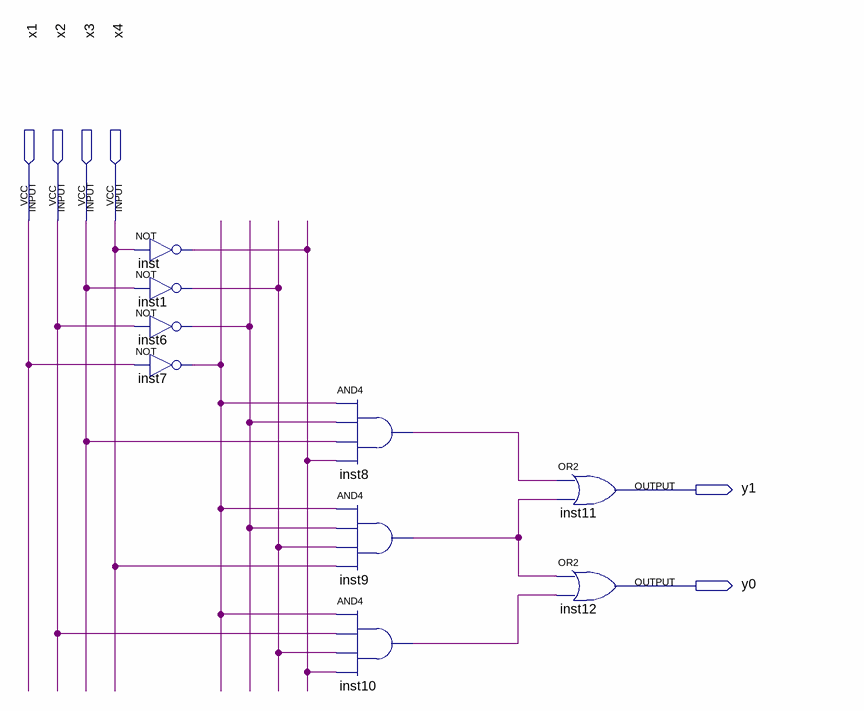
[diagram p0: schematic sheet]
// Quartus schematic scheme2.bdf as structural Verilog: 9 symbols, 6 pins
module scheme2 (
  input  x1,
  input  x2,
  input  x3,
  input  x4,
  output y1,
  output y0
);

  wire inst1_out, inst6_out, inst7_out, inst8_out, inst9_out, inst10_out, inst_out;

  not inst (inst_out, x4);
  not inst1 (inst1_out, x3);
  not inst6 (inst6_out, x2);
  not inst7 (inst7_out, x1);
  and inst8 (inst8_out, inst7_out, inst6_out, x3, inst_out);
  and inst9 (inst9_out, inst7_out, inst6_out, inst1_out, x4);
  and inst10 (inst10_out, inst7_out, x2, inst1_out, inst_out);
  or inst11 (y1, inst8_out, inst9_out);
  or inst12 (y0, inst9_out, inst10_out);
endmodule
